# EAGLE design BLE Monitor Orientation Sensor (EAGLE 9.2.2)
CREVISION: 1; DESIGNER: Roshni Sharma, TJ Rodriguez
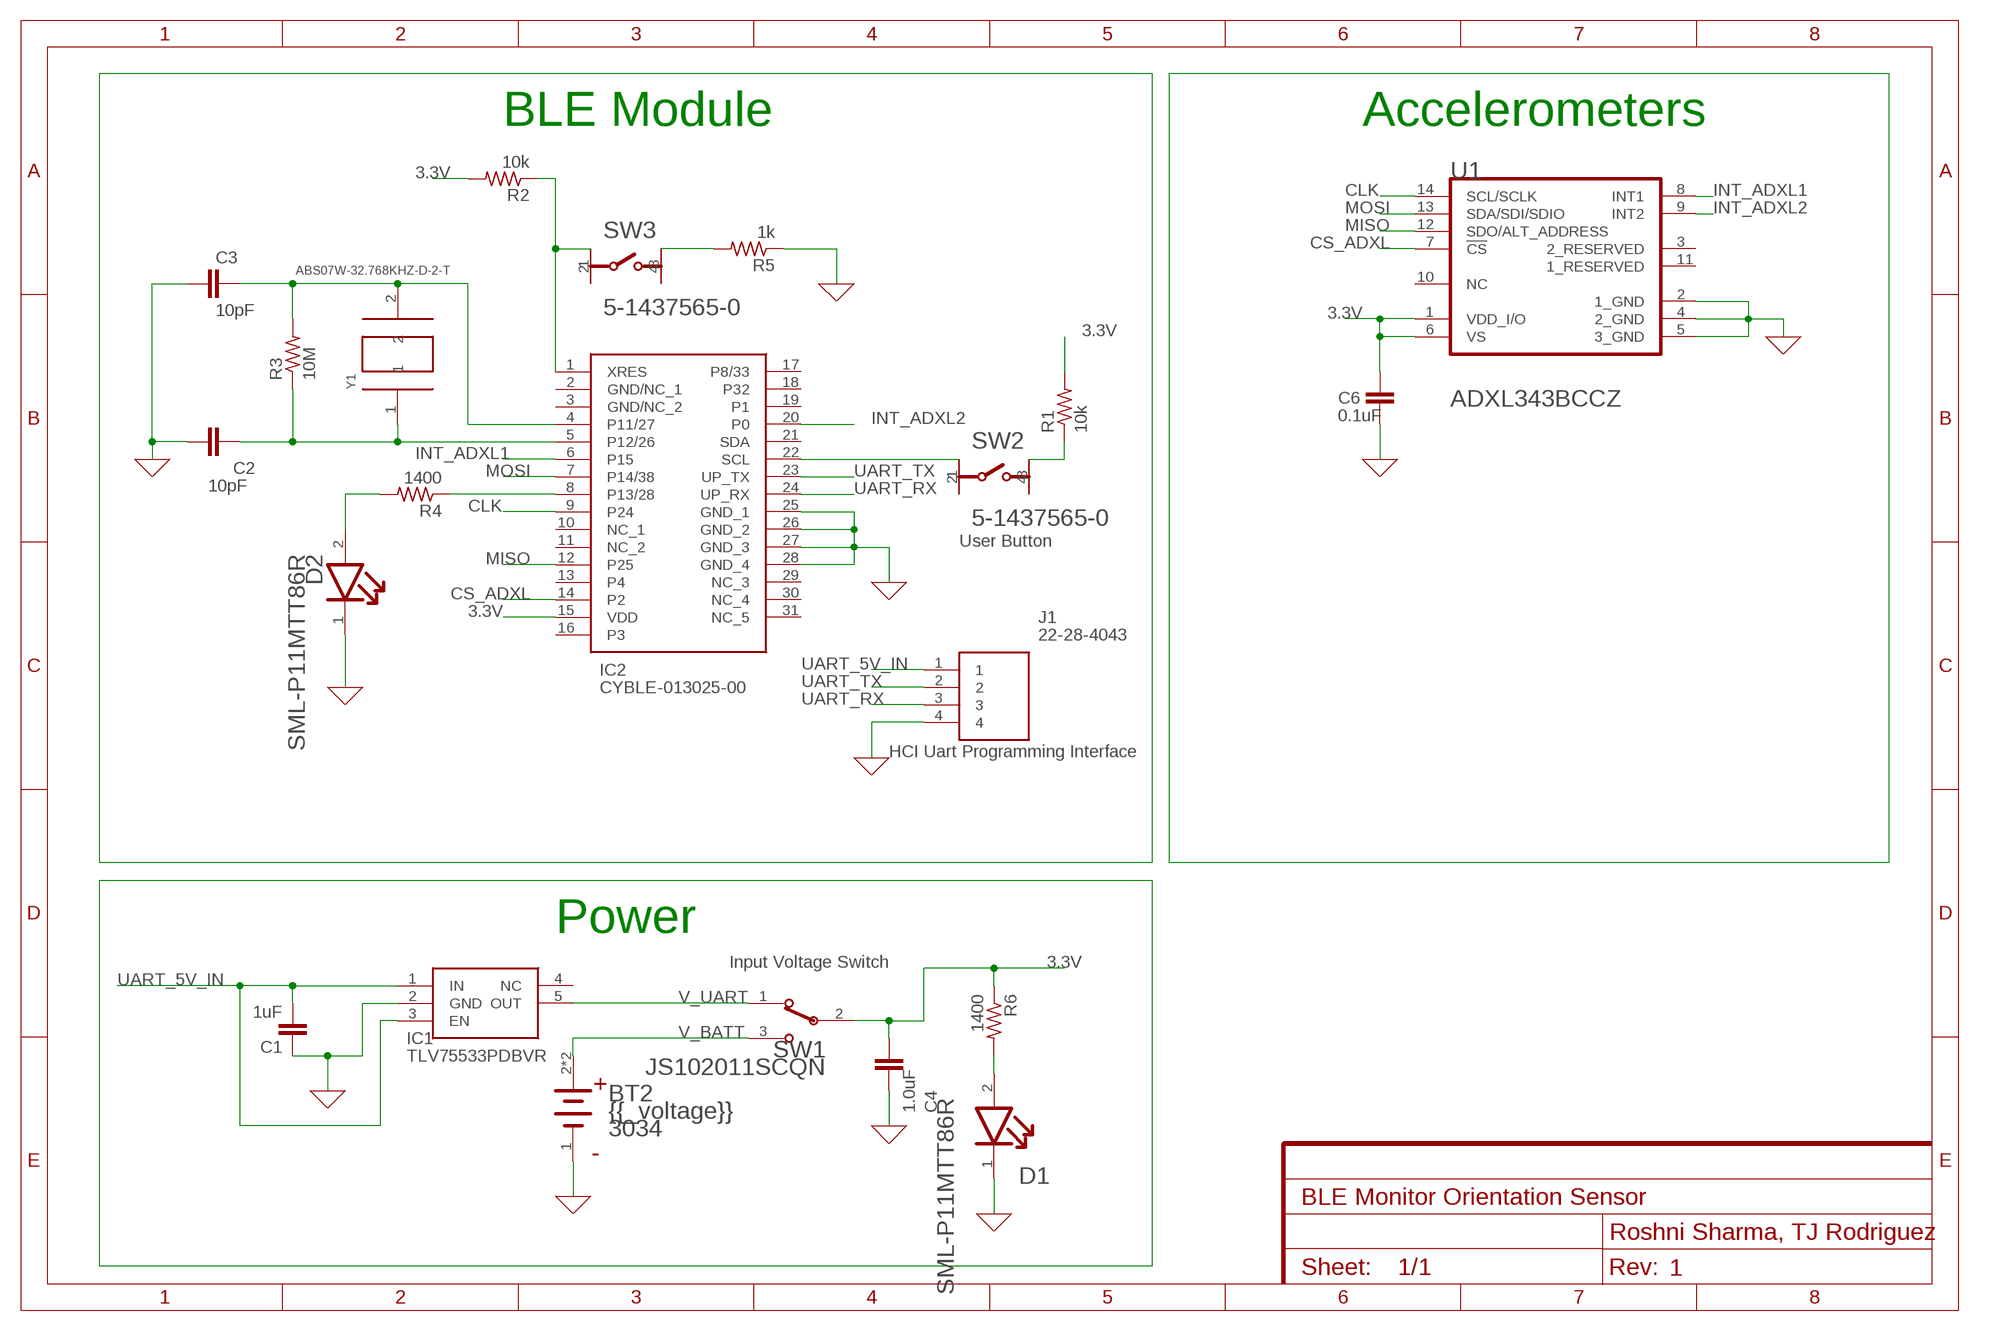
[diagram p0: schematic, sheet 1]

## Parts
BT2  KEYSTONE_ELECTRONICS_3034KEYSTONE_ELECTRONICS_3034_0_0  [KEYSTONE_ELECTRONICS_3034_0]
C1  1uF  10PF-0603-50V-5%  [0603]
C2  10pF  10PF-0603-50V-5%  [0603]
C3  10pF  10PF-0603-50V-5%  [0603]
C4  1.0uF  1.0UF-0603-16V-10%  [0603]
C6  0.1uF  10PF-0603-50V-5%  [0603]
D1  ROHM_SML-P11MTT86RROHM_SML-P11MTT86R_0_0  [ROHM_SML-P11MTT86R_0]
D2  ROHM_SML-P11MTT86RROHM_SML-P11MTT86R_0_0  [ROHM_SML-P11MTT86R_0]
IC1  TLV75533PDBVR  [SOT95P280X145-5N]
IC2  CYBLE-013025-00  [CYBLE01302500]
J1  22-28-4043  [HDRV4W87P0X254_1X4_1016X249X86]
R1  10k  R-US_R0603  [R0603]
R2  10k  R-US_R0603  [R0603]
R3  10M  R-US_R0603  [R0603]
R4  1400  R-US_R0603  [R0603]
R5  1k  R-US_R0603  [R0603]
R6  1400  R-US_R0603  [R0603]
SW1  C&K_JS102011SCQNC&K_JS102011SCQN_0_0  [C&K_JS102011SCQN_0]
SW2  TE_CONNECTIVITY_5-1437565-0TE_CONNECTIVITY_5-1437565-0_0_0  [TE_CONNECTIVITY_5-1437565-0_0]
SW3  TE_CONNECTIVITY_5-1437565-0TE_CONNECTIVITY_5-1437565-0_0_0  [TE_CONNECTIVITY_5-1437565-0_0]
U1  ANALOG_DEVICES_ADXL343BCCZANALOG_DEVICES_ADXL343BCCZ_0_0  [ANALOG_DEVICES_ADXL343BCCZ_0]
Y1  ABS07W-32.768KHZ-D-2-T  [XTAL320X150X90]

## Nets
3.3V [power_500mA_5V]: C4.1 C6.2 IC2.15(VDD) R1.2 R2.2 R6.1 SW1.2 U1.1(VDD_I/O) U1.6(VS)
CLK: IC2.9(P24) U1.14(SCL/SCLK)
CS_ADXL: IC2.14(P2) U1.7(!CS!)
GND: BT2.1(CATHODE) C1.1 C2.1 C3.1 C4.2 C6.1 D1.1(CATHODE) D2.1(CATHODE) IC1.2(GND) IC2.25(GND_1) IC2.26(GND_2) IC2.27(GND_3) IC2.28(GND_4) J1.4 R5.1 U1.2(1_GND) U1.4(2_GND) U1.5(3_GND)
INT_ADXL1: IC2.6(P15) U1.8(INT1)
INT_ADXL2: IC2.20(P0) U1.9(INT2)
MISO: IC2.12(P25) U1.12(SDO/ALT_ADDRESS)
MOSI: IC2.7(P14/38) U1.13(SDA/SDI/SDIO)
N$1: R1.1 SW2.3
N$2: IC2.1(XRES) R2.1 SW3.1
N$3: IC2.22(SCL) SW2.1
N$4: IC2.8(P13/28) R4.1
N$5: D1.2(ANODE) R6.2
N$6: D2.2(ANODE) R4.2
N$7: R5.2 SW3.3
N$8: C2.2 IC2.5(P12/26) R3.1 Y1.1
N$9: C3.2 IC2.4(P11/27) R3.2 Y1.2
UART_5V_IN: C1.2 IC1.1(IN) IC1.3(EN) J1.1
UART_RX: IC2.24(UP_RX) J1.3
UART_TX: IC2.23(UP_TX) J1.2
V_BATT: BT2.2(ANODE) BT2.2-2(ANODE) SW1.3
V_UART: IC1.5(OUT) SW1.1
Unconnected: IC1.4(NC) IC2.2(GND/NC_1) IC2.3(GND/NC_2) IC2.10(NC_1) IC2.11(NC_2) IC2.13(P4) IC2.16(P3) IC2.17(P8/33) IC2.18(P32) IC2.19(P1) IC2.21(SDA) IC2.29(NC_3) IC2.30(NC_4) IC2.31(NC_5) SW2.2 SW2.4 SW3.2 SW3.4 U1.3(2_RESERVED) U1.10(NC) U1.11(1_RESERVED)

## Notes on the sheet
- BLE Module | Accelerometers
- Power

## Library data of the parts
BT2 = Keystone Electronics - 3034:KEYSTONE_ELECTRONICS_3034: Coin Cell Battery Holders COIN CELL RETAINER; AUTOMOTIVE: No; CENTROID_NOT_SPECIFIED: No; CONTACT_MATERIAL: Nickel; DATASHEET: https://www.keyelco.com/product-pdf.cfm?p=798; DEVICE_CLASS_L1: Connectors; DEVICE_CLASS_L2: unset; DEVICE_CLASS_L3: unset; DIGIKEY_DESCRIPTION: BATTERY RETAINER COIN 20MM SMD; DIGIKEY_PART_NUMBER: 36-3034-ND; FOOTPRINT_VARIANT_NAME_0: Recommended_Land_Pattern; HEIGHT: 4.31mm; LEAD_FREE: Yes; MF: Keystone Electronics; MFG_PACKAGE_IDENT: 3034; MFG_PACKAGE_IDENT_DATE: 0; MFG_PACKAGE_IDENT_REV: 0; MOUSER_DESCRIPTION: Coin Cell Battery Holders COIN CELL RETAINER; MOUSER_PART_NUMBER: 534-3034; MPN: 3034; NUMBER_OF_CONTACTS: 2; PACKAGE: SMT_COIN_CELL; PREFIX: BT; ROHS: Yes; VERIFICATION_VERSION: 0.0.0.2
C1 C6 = SparkFun-Capacitors:10PF: 10pF ceramic capacitors A capacitor is a passive two-terminal electrical component used to store electrical energy temporarily in an electric field.; PROD_ID: CAP-11812; VALUE: 10pF
C2 C3 = SparkFun-Capacitors:10PF: 10pF ceramic capacitors A capacitor is a passive two-terminal electrical component used to store electrical energy temporarily in an electric field.; PROD_ID: CAP-11812
C4 = SparkFun-Capacitors:1.0UF: 1µF ceramic capacitors A capacitor is a passive two-terminal electrical component used to store electrical energy temporarily in an electric field.; PROD_ID: CAP-00868
D1 D2 = ROHM - SML-P11MTT86R:ROHM_SML-P11MTT86R: LED Uni-Color Yellow Green Chip LED 2-Pin 0402 T/R; AUTOMOTIVE: No; CENTROID_NOT_SPECIFIED: No; COLOUR: Yellowish Green; DATASHEET: https://www.rohm.com/datasheet/SML-P11MT(R)/sml-p11-e; DEVICE_CLASS_L1: Optoelectronics; DEVICE_CLASS_L2: LEDs; DEVICE_CLASS_L3: unset; DIGIKEY_DESCRIPTION: DIODE LED YELLOW-GRN CLEAR 0402 SMD; DIGIKEY_PART_NUMBER: 846-1211-1-ND; FOOTPRINT_VARIANT_NAME_0: Recommended_Land_Pattern; FORWARD_CURRENT: 1mA; FORWARD_VOLTAGE: 1.9V; HEIGHT: 0.25mm; LEAD_FREE: Yes; LED_ORIENTATION: Top View; LUMINOUS_INTENSITY: 2.1mcd; MF: ROHM; MFG_PACKAGE_IDENT: SML-P1; MFG_PACKAGE_IDENT_DATE: 0; MFG_PACKAGE_IDENT_REV: 0; MOUSER_DESCRIPTION: SML-P11 Series Yellow Green 0402 Clear 2.1 mcd 1.9 V Surface Mount PICOLED? LED; MOUSER_PART_NUMBER: 755-SML-P11MTT86R; MPN: SML-P11MTT86R; PACKAGE: 0402; POWER_DISSIPATION: 54mW; PREFIX: D; REVERSE_VOLTAGE: 5V; ROHS: Yes; TEMPERATURE_RANGE_HIGH: +85°C; TEMPERATURE_RANGE_LOW: -40°C; VERIFICATION_VERSION: 0.0.0.1; WAVELENGTH: 569nm
IC1 = TLV75533PDBVR:TLV75533PDBVR: LDO Voltage Regulators 500-mA, Low IQ, Small Size, Low Dropout Regulator 5-SOT-23 -40 to 125 Source: Datasheet <http://www.ti.com/lit/gpn/tlv755p>; ARROW_PART_NUMBER: TLV75533PDBVR; ARROW_PRICE-STOCK: https://www.arrow.com/en/products/tlv75533pdbvr/texas-instruments; DESCRIPTION: LDO Voltage Regulators 500-mA, Low IQ, Small Size, Low Dropout Regulator 5-SOT-23 -40 to 125; HEIGHT: 1.45mm; MANUFACTURER_NAME: Texas Instruments; MANUFACTURER_PART_NUMBER: TLV75533PDBVR; MOUSER_PART_NUMBER: 595-TLV75533PDBVR; MOUSER_PRICE-STOCK: https://www.mouser.co.uk/ProductDetail/Texas-Instruments/TLV75533PDBVR?qs=55YtniHzbhAKEwqeO2xJXQ%3D%3D
IC2 = SamacSys_Parts:CYBLE-013025-00: Bluetooth Modules (802.15.1) BLE Module Source: Datasheet <https://www.arrow.com/en/products/cyble-013025-00/cypress-semiconductor>; ARROW_PART_NUMBER: CYBLE-013025-00; ARROW_PRICE-STOCK: https://www.arrow.com/en/products/cyble-013025-00/cypress-semiconductor; DESCRIPTION: Bluetooth Modules (802.15.1) BLE Module; HEIGHT: 2.25mm; MANUFACTURER_NAME: Cypress Semiconductor; MANUFACTURER_PART_NUMBER: CYBLE-013025-00; MOUSER_PART_NUMBER: 727-CYBLE-013025-00; MOUSER_PRICE-STOCK: https://www.mouser.co.uk/ProductDetail/Cypress-Semiconductor/CYBLE-013025-00?qs=F5EMLAvA7IA%252BPnWrPsxPuQ%3D%3D; SPICEPREFIX: X
J1 = 22-28-4043:22-28-4043: Molex 42375 Series, Series Number 2228, 2.54mm Pitch 4 Way 1 Row Straight PCB Header, Solder Termination, 4A Source: Datasheet <https://componentsearchengine.com/Datasheets/1/22-28-4043.pdf>; DESCRIPTION: Molex 42375 Series, Series Number 2228, 2.54mm Pitch 4 Way 1 Row Straight PCB Header, Solder Termination, 4A; FUNCTION: HCI Uart Programming Interface; HEIGHT: 8.63mm; MANUFACTURER_NAME: Molex; MANUFACTURER_PART_NUMBER: 22-28-4043; MOUSER_PART_NUMBER: 538-22-28-4043; MOUSER_PRICE-STOCK: https://www.mouser.com/Search/Refine.aspx?Keyword=538-22-28-4043
R1-R6 = rcl:R-US_: RESISTOR, American symbol; SPICEPREFIX: R
SW1 = C&K - JS102011SCQN:C&K_JS102011SCQN: Switch Slide SPDT Top Slide 0.3A 30VDC Gull Wing SMD T/R; CENTROID_NOT_SPECIFIED: No; CONTACT_CURRENT_RATING: 0.3A; CONTACT_RESISTANCE: 70mΩ; CURRENT_RATING: 300mA; DATASHEET: https://www.ckswitches.com/media/1422/js.pdf; DEVICE_CLASS_L1: Electromechanical; DEVICE_CLASS_L2: Switches; DEVICE_CLASS_L3: Slide Switches; DIGIKEY_DESCRIPTION: SWITCH SLIDE SPDT 300MA 6V; DIGIKEY_PART_NUMBER: CKN10877CT-ND; ELECTROMECHANICAL_LIFE: 5000Cycles; FUNCTION: Input Voltage Switch; HEIGHT: 5.5mm; LEAD_FREE: yes; MF: C&K; MFG_PACKAGE_IDENT: JS102011SCQN; MFG_PACKAGE_IDENT_DATE: 0; MFG_PACKAGE_IDENT_REV: 0; MOUSER_DESCRIPTION: Switch Slide SPDT Top Slide 0.3A 30VDC Gull Wing SMD T/R; MOUSER_PART_NUMBER: 611-JS102011SCQN; MPN: JS102011SCQN; PACKAGE: SMT_SW_8MM5_3MM5; PREFIX: SW; ROHS: yes; TEMPERATURE_RANGE_HIGH: +85°C; TEMPERATURE_RANGE_LOW: -40°C; THROW_CONFIGURATION: SPDT; VERIFICATION_VERSION: 0.0.0.1; VOLTAGE_RATING_DC: 6V
SW2 = TE Connectivity - 5-1437565-0:TE_CONNECTIVITY_5-1437565-0: TE CONNECTIVITY / ALCOSWITCH Tactile Switch, Non Illuminated, 24 V, 50 mA, 150 gf, Solder; AUTOMOTIVE: No; CENTROID_NOT_SPECIFIED: No; CONTACT_CURRENT_RATING: 50mA; CONTACT_RESISTANCE: 100mΩ; DATASHEET: https://www.te.com/commerce/DocumentDelivery/DDEController?Action=showdoc&DocId=Customer+Drawing%7F2-1437565-7%7FV%7Fpdf%7FEnglish%7FENG_CD_2-1437565-7_V.pdf%7F3-1437565-0; DEVICE_CLASS_L1: Electromechanical; DEVICE_CLASS_L2: Switches; DEVICE_CLASS_L3: Tactile Switches; DIGIKEY_DESCRIPTION: SWITCH TACTILE SPST-NO 0.05A 24V; DIGIKEY_PART_NUMBER: 450-2058-1-ND; ELECTROMECHANICAL_LIFE: 100000Cycles; FOOTPRINT_VARIANT_NAME_0: Recommended_Land_Pattern; FUNCTION: User Button; HEIGHT: 7.26mm; LEAD_FREE: Yes; MF: TE Connectivity; MFG_PACKAGE_IDENT: 5-1437565-0; MFG_PACKAGE_IDENT_DATE: 0; MFG_PACKAGE_IDENT_REV: 0; MOUSER_DESCRIPTION: Tactile Switches FSM6JSMATR; MOUSER_PART_NUMBER: 506-5-1437565-0; MPN: 5-1437565-0; OPERATING_FORCE: 160gf; PACKAGE: SMT_SW_6MM0_6MM9; PREFIX: SW; ROHS: Yes; STANDOFF_HEIGHT: 0.05mm; TEMPERATURE_RANGE_HIGH: +85°C; TEMPERATURE_RANGE_LOW: -35°C; THROW_CONFIGURATION: SPST; VERIFICATION_VERSION: 0.0.0.1; VOLTAGE_RATING_DC: 24V
SW3 = TE Connectivity - 5-1437565-0:TE_CONNECTIVITY_5-1437565-0: TE CONNECTIVITY / ALCOSWITCH Tactile Switch, Non Illuminated, 24 V, 50 mA, 150 gf, Solder; AUTOMOTIVE: No; CENTROID_NOT_SPECIFIED: No; CONTACT_CURRENT_RATING: 50mA; CONTACT_RESISTANCE: 100mΩ; DATASHEET: https://www.te.com/commerce/DocumentDelivery/DDEController?Action=showdoc&DocId=Customer+Drawing%7F2-1437565-7%7FV%7Fpdf%7FEnglish%7FENG_CD_2-1437565-7_V.pdf%7F3-1437565-0; DEVICE_CLASS_L1: Electromechanical; DEVICE_CLASS_L2: Switches; DEVICE_CLASS_L3: Tactile Switches; DIGIKEY_DESCRIPTION: SWITCH TACTILE SPST-NO 0.05A 24V; DIGIKEY_PART_NUMBER: 450-2058-1-ND; ELECTROMECHANICAL_LIFE: 100000Cycles; FOOTPRINT_VARIANT_NAME_0: Recommended_Land_Pattern; FUNCTION: Reset; HEIGHT: 7.26mm; LEAD_FREE: Yes; MF: TE Connectivity; MFG_PACKAGE_IDENT: 5-1437565-0; MFG_PACKAGE_IDENT_DATE: 0; MFG_PACKAGE_IDENT_REV: 0; MOUSER_DESCRIPTION: Tactile Switches FSM6JSMATR; MOUSER_PART_NUMBER: 506-5-1437565-0; MPN: 5-1437565-0; OPERATING_FORCE: 160gf; PACKAGE: SMT_SW_6MM0_6MM9; PREFIX: SW; ROHS: Yes; STANDOFF_HEIGHT: 0.05mm; TEMPERATURE_RANGE_HIGH: +85°C; TEMPERATURE_RANGE_LOW: -35°C; THROW_CONFIGURATION: SPST; VERIFICATION_VERSION: 0.0.0.1; VOLTAGE_RATING_DC: 24V
U1 = Analog Devices - ADXL343BCCZ:ANALOG_DEVICES_ADXL343BCCZ: ADI-ADXL34X-CC-14-1; 3DB_BANDWIDTH: 1.6 KHz; CIIVA_IDS: 2416245; COMPONENT_LINK_1_DESCRIPTION: Manufacturer URL; COMPONENT_LINK_1_URL: http://www.analog.com/en/index.html; COMPONENT_LINK_3_DESCRIPTION: Package Specification; COMPONENT_LINK_3_URL: http://www.analog.com/static/imported-files/data_sheets/ADXL343.pdf; COMPONENT_LINK_4_DESCRIPTION: Product URL; COMPONENT_LINK_4_URL: http://www.analog.com/en/mems-sensors/mems-inertial-sensors/adxl343/products/product.html; DATASHEET: http://www.analog.com/static/imported-files/data_sheets/ADXL343.pdf; DATASHEET_VERSION: Rev. 0; FOOTPRINT_VARIANT_NAME_0: Manufacturer Recommended; IMPORTED: yes; IMPORTED_FROM: vault; IMPORT_TS: 1521862076; MF: Analog Devices; MOUNTING_TECHNOLOGY: Surface Mount; MPN: ADXL343BCCZ; OF_AXES: 3; OUTPUT_TYPE: Digital; PACKAGE: CC-14-1; PACKAGE_DESCRIPTION: 14-Pin Land Grid Array, 3 x 5 mm Body, 0.8 mm Pitch; PACKAGE_VERSION: 03-16-2010-A, 03/2010; PACKING: Tray; PIN_0_0_13_INSIDE_EDGE: clock; PREFIX: U; RELEASE_DATE: 1396258511; SENSITIVITY: 256/128/64/32 LSB/g; VAULT_GUID: 1FF5E9B5-0480-4B9F-B006-41E6078ADD26; VAULT_REVISION: DC90A2D0-DCCE-40AA-9931-88A066B9F432; VOLTAGE_SUPPLY_V: 2.0 to 3.6
Y1 = ABS07W-32.768KHZ-D-2-T:ABS07W-32.768KHZ-D-2-T: ABS07 Series 32.768 kHz ±20 ppm 12.5 pF -40 to +85 C SMT Low Profile Crystal; DESCRIPTION: 32.768kHz ±20ppm Crystal 3pF 55 kOhms 2-SMD, No Lead; DIGI-KEY_PART_NUMBER: 535-14105-1-ND; MF: Abracon; MP: ABS07W-32.768KHZ-D-2-T; PACKAGE: SMD-2 Abracon; PURCHASE-URL: https://pricing.snapeda.com/search/part/ABS07W-32.768KHZ-D-2-T/?ref=eda; SPICEPREFIX: B

## Net classes
0 signal: width 0.152 mm, clearance 0.152 mm
1 power_500mA_5V: width 0.254 mm, clearance 0.152 mm

## Board
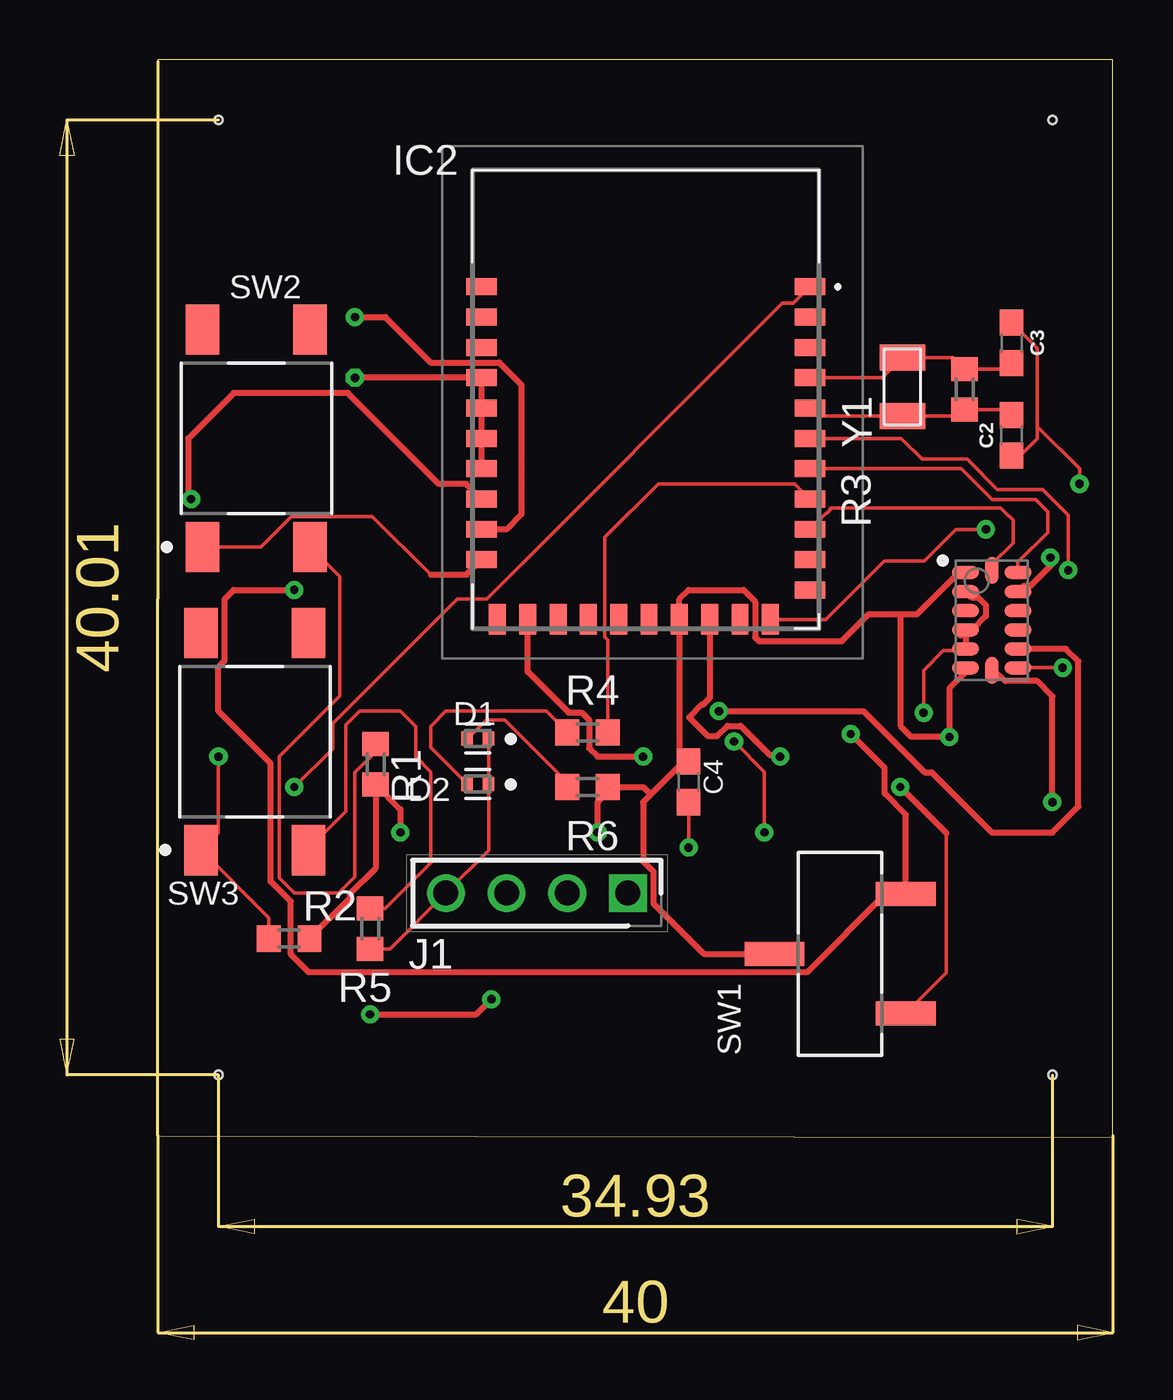
[diagram p1: board, top side]
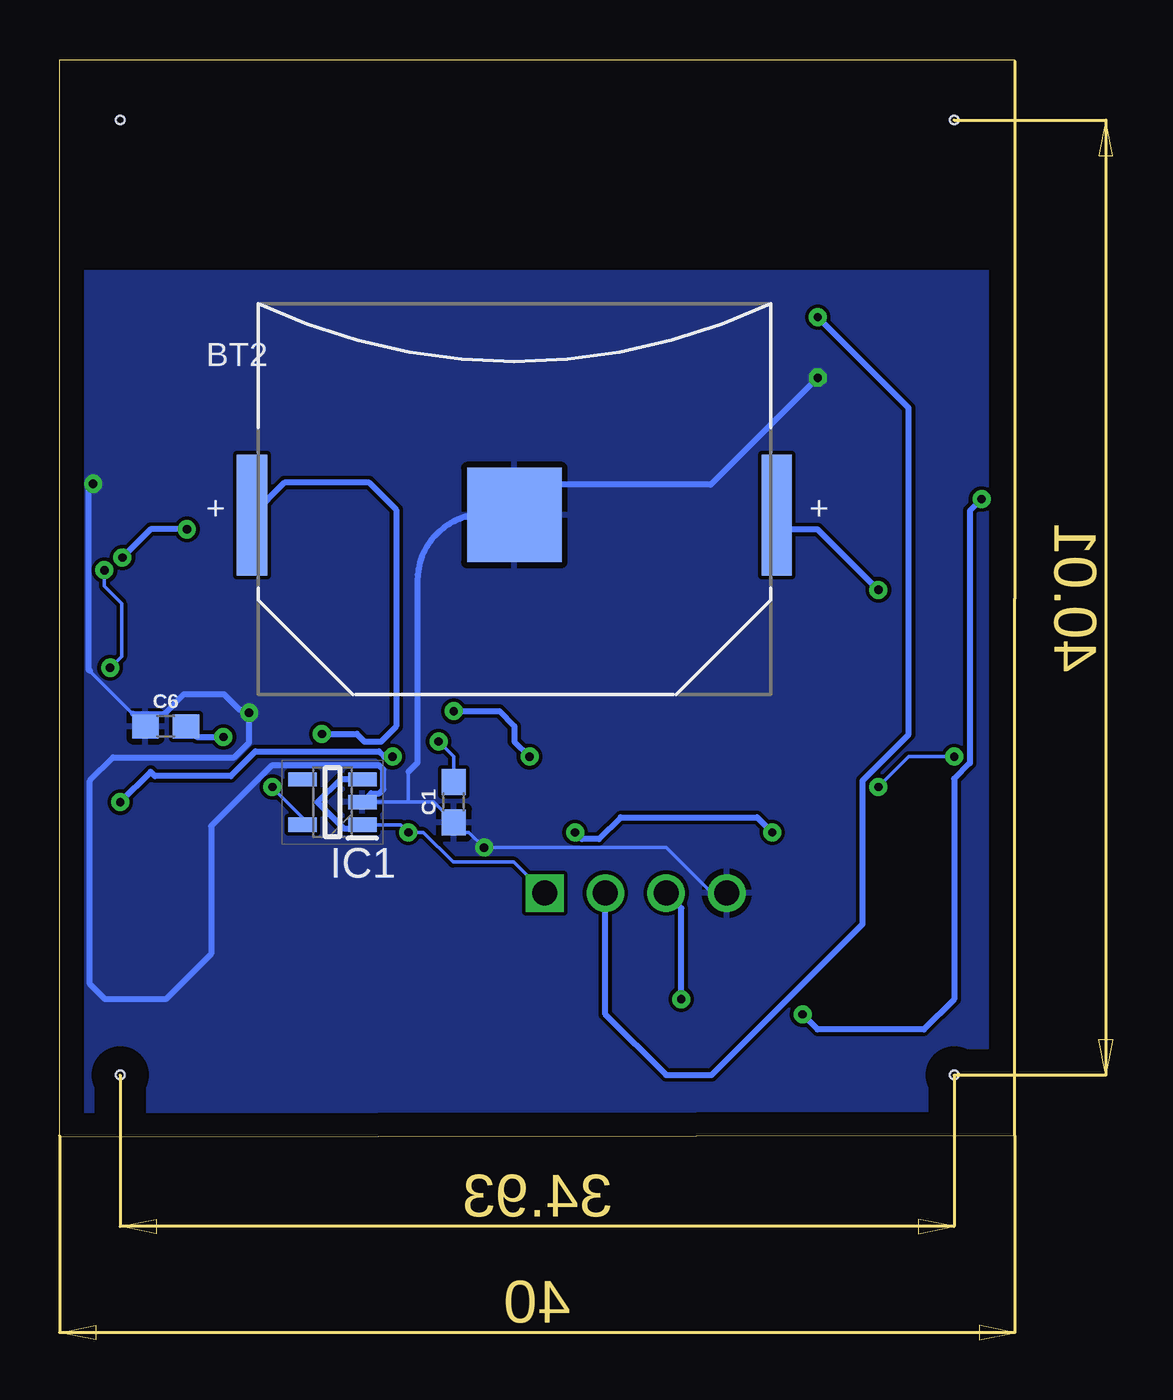
[diagram p2: board, bottom side, seen from below]

Size 39.99 x 45.14 mm. Coordinates in mm from the lower left corner, seen from the top.
Outline: 0,0.06 39.99,0 39.99,45.14 0,45.14 0,0.06
Copper layers (1*16): Top 0.035mm / dielectric 1.5mm / Bottom 0.035mm
Design rules "default": minimum track width 6mil, minimum drill 0.35mm, track to track 6mil, track to pad 6mil, pad to pad 6mil, via to via 6mil, smd to smd 6mil, copper to edge 40mil, drill to drill 6mil, minimum pad ring 10mil, minimum via ring 8mil, stop-mask expansion 4mil, vias tented up to drill 0mil, thermal gap 10mil
Holes 0.35 mm at 2.54,2.6 37.47,2.6 2.54,42.61 37.47,42.61

### Footprints (pad centres in the part's own frame; a part is rotated, then mirrored left to right if it is on the bottom)
KEYSTONE_ELECTRONICS_3034_0 = smd 3.96 x 3.96: 1 0,-0.67 | smd 1.27 x 5.08: 2 -10.985,-0.67; 2-2 10.985,-0.67
0603 = smd 1.1 x 1: 1 -0.85,0; 2 0.85,0
ROHM_SML-P11MTT86R_0 = smd 0.5 x 0.6: 1 -0.45,0; 2 0.45,0
SOT95P280X145-5N = smd 1.2 x 0.6: 1 -1.25,0.95; 2 -1.25,0; 3 -1.25,-0.95; 4 1.25,-0.95; 5 1.25,0.95
CYBLE01302500 = smd 1.27 x 0.71: 1 0,0; 2 0,-1.27; 3 0,-2.54; 4 0,-3.81; 5 0,-5.08; 6 0,-6.35; 7 0,-7.62; 8 0,-8.89; 9 0,-10.16; 10 0,-11.43; 11 0,-12.7; 22 -13.75,-11.43; 23 -13.75,-10.16; 24 -13.75,-8.89; 25 -13.75,-7.62; 26 -13.75,-6.35; 27 -13.75,-5.08; 28 -13.75,-3.81; 29 -13.75,-2.54; 30 -13.75,-1.27; 31 -13.75,0 | smd 0.71 x 1.27: 12 -1.655,-13.935; 13 -2.925,-13.935; 14 -4.195,-13.935; 15 -5.465,-13.935; 16 -6.735,-13.935; 17 -8.005,-13.935; 18 -9.275,-13.935; 19 -10.545,-13.935; 20 -11.815,-13.935; 21 -13.085,-13.935
HDRV4W87P0X254_1X4_1016X249X86 = drill 1.05 pad 1.575 square: 1 0,0 | drill 1.05 pad 1.575: 2 2.54,0; 3 5.08,0; 4 7.62,0
R0603 = smd 1 x 1.1: 1 -0.85,0; 2 0.85,0
C&K_JS102011SCQN_0 = smd 1 x 2.5: 1 -2.5,-2.75; 2 0,2.75; 3 2.5,-2.75
TE_CONNECTIVITY_5-1437565-0_0 = smd 1.4 x 2.1: 1 2.25,4.55; 2 2.25,-4.55; 3 -2.25,4.55; 4 -2.25,-4.55
ANALOG_DEVICES_ADXL343BCCZ_0 = smd 1.145 x 0.55: 1 -1.098,2; 2 -1.098,1.2; 3 -1.098,0.4; 4 -1.098,-0.4; 5 -1.098,-1.2; 6 -1.098,-2; 8 1.097,-2; 9 1.097,-1.2; 10 1.097,-0.4; 11 1.097,0.4; 12 1.097,1.2; 13 1.097,2 | smd 0.55 x 1.145: 7 0,-2.097; 14 0,2.097
XTAL320X150X90 = smd 1.092 x 1.905: 1 -1.219,0; 2 1.219,0

### Placement (x,y rotation side)
BT2  20.95,26.73 0 bottom
C1  23.5,14.03 90 bottom
C2  35.75,29.4 90 top
C3  35.75,33.27 270 top
C4  22.23,14.88 270 top
C6  35.56,17.21 0 bottom
D1  13.4,16.7 180 top
D2  13.4,14.8 180 top
IC1  28.57,14.03 180 bottom
IC2  27.3,35.62 0 top
J1  19.68,10.22 180 top
R1  9.12,15.62 270 top
R2  5.5,8.32 0 top
R3  33.78,31.33 90 top
R4  18,16.95 180 top
R5  8.89,8.74 90 top
R6  18,14.67 180 top
SW1  28.57,7.68 90 top
SW2  4.13,29.27 180 top
SW3  4.06,16.57 180 top
U1  34.92,21.65 0 top
Y1  31.18,31.43 90 top

### Tracks (layer width: path | path; a pad name or v marks a point on that pad's centre or on a via)
3.3V  (via drill 0.35)
  Top 0.254: 22.12,15.84 21.84,16.12 IC2.15 21.84,22.54 22.23,22.92 24.53,22.92 25.02,22.44 25.02,20.94 25.18,20.77 28.64,20.77 29.78,21.91 31.11,21.91 | 22.12,15.84 C4.1 | R2.2 8.06,10.03 8.06,10.21 9.12,11.26 R1.2 10.16,13.73 v10.16,12.76 | 20.64,14.35 20.32,14.03 20.32,11.56 20.75,11.13 20.75,9.79 22.86,7.68 SW1.2 | 20.64,14.35 22.12,15.84 | R6.1 19.05,14.67 | 19.05,14.67 20.32,14.67 20.64,14.35 | U1.6 33.83,19.49 33.15,18.81 v33.15,16.77 31.56,16.77 31.11,17.21 31.11,21.91 | v18.41,12.76 18.41,14.03 19.05,14.67 | U1.1 33.69,23.52 33.41,23.52 31.8,21.91 31.11,21.91
  Bottom 0.254: v10.16,12.76 10.79,13.4 16.51,13.4 17.42,12.48 18.14,12.48 v18.41,12.76 | C6.2 34.27,16.77 v33.15,16.77
CLK
  Top 0.152: U1.14 34.92,24 34.93,24 35.81,24.89 35.81,25.84 35.75,25.91 35.56,26.1 35.31,26.35 28.19,26.35 28.17,26.33 28.17,26.28 28.04,26.15 27.99,26.15 IC2.9
CS_ADXL  (via drill 0.35)
  Top 0.254: IC2.14 23.11,18.39 22.84,18.12 22.77,18.12 22.25,17.59 23.03,16.81 23.43,16.81 23.86,17.23 24.4,17.23 25.63,16 26.04,16 26.06,15.98 v26.06,15.94 | v37.47,14.03 37.47,18.46 36.83,19.1 35.49,19.1 35.04,19.56 U1.7
  Bottom 0.254: v26.06,15.94 26.41,15.94 26.63,16.16 31.8,16.16 32.84,15.13 36.02,15.13 36.2,15.3 v37.47,14.03
GND  (via drill 0.35)
  Top 0.152: U1.5 33.76,20.39 32.89,20.39 32.89,20.38 32.07,19.56 v32.07,17.78 | R5.1 9.73,7.89 J1.4 13.85,12.01 D2.1 D1.1 | C2.1 36.11,28.55 36.83,29.27 36.83,29.77 | 36.83,29.77 36.83,33.05 C3.1 | C4.2 v22.23,12.13 | v38.6,27.37 38.6,28 36.83,29.77
  Top 0.254: U1.4 U1.5 | U1.4 arc-90 33.59,21.02 U1.4 | v8.26,31.81 IC2.28 IC2.27 IC2.26 IC2.25 | U1.4 34.11,21.25 34.68,21.82 34.68,22.28 34.35,22.61 34.07,22.61 U1.2
  Bottom 0.152: 21.59,26.06 BT2.1 19.68,27.33 | IC1.2 25.4,14.03 | 25.4,14.03 24.34,14.03 23.6,13.29 | 23.6,13.29 C1.1 | 25.4,15.3 25.4,14.03 | 23.6,13.29 23.5,13.4 23.5,12.76 22.86,12.76 v22.23,12.13 14.61,12.13 12.7,10.22 J1.4 | C6.1 36.94,17.74 38.73,19.53
  Bottom 0.254: 21.59,26.06 22.19,26.06 arc90 22.23,26.1 arc-90 25.02,23.3 25.02,15.69 25.4,15.3 | v8.26,31.81 12.73,27.33 19.68,27.33 | IC1.2 26.95,14.4 26.61,14.4 26.45,14.57 26.45,15.4 26.61,15.56 31.13,15.56 33.66,13.04 33.66,7.68 35.56,5.78 38.1,5.78 38.73,6.41 38.73,14.94 37.76,15.91 32.69,15.91 32.07,16.53 v32.07,17.78 32.19,17.91 32.47,17.91 33.12,18.56 34.8,18.56 35.63,17.74 36.94,17.74 | 38.73,19.53 38.79,19.59 38.79,27.18 v38.6,27.37
  pour Bottom: 0,0.06 0,36.26 40.01,36.26 40.01,0.06
INT_ADXL1  (via drill 0.35)
  Top 0.152: IC2.6 31.13,29.27 32.01,28.4 33.9,28.4 35.16,27.14 37.06,27.14 38.13,26.07 v38.13,23.75 | v37.89,19.66 36.03,19.66 U1.8
  Bottom 0.152: v38.13,23.75 38.13,23.08 37.4,22.35 37.4,20.13 37.87,19.66 v37.89,19.66
INT_ADXL2  (via drill 0.35)
  Top 0.254: v23.5,17.84 29.55,17.84 32.11,15.28 32.41,15.28 34.92,12.76 37.47,12.76 38.55,13.85 38.55,19.94 38.03,20.45 U1.9 | v20.32,15.94 18.42,15.94 18.07,16.29 18.07,17.48 17.76,17.78 17.2,17.78 15.49,19.5 IC2.20
  Bottom 0.254: v23.5,17.84 21.59,17.84 20.95,17.21 20.95,16.57 v20.32,15.94
MISO  (via drill 0.35)
  Top 0.152: IC2.12 27.98,21.69 30.42,24.14 32.09,24.14 33.41,25.46 v34.67,25.46
  Top 0.254: U1.12 36.27,23.1 36.55,23.1 37.38,23.93 v37.38,24.28
  Bottom 0.254: v37.38,24.28 36.19,25.47 v34.67,25.47 v34.67,25.46
MOSI
  Top 0.152: IC2.7 33.66,28 34.95,26.71 36.77,26.71 37.27,26.2 37.27,25.34 36.02,24.08 U1.13
N$1
  Top 0.152: SW2.3 7.62,23.48 7.62,18.48 5.08,15.94 5.08,10.86 5.71,10.22 7.58,10.22 8.26,10.9 8.26,15.28 9.12,16.14 R1.1
N$2  (via drill 0.35)
  Top 0.152: R2.1 4.65,9.19 SW3.1 2.54,12.75 v2.54,15.94 | IC2.1 26.62,34.94 26.16,34.94 13.77,22.55 12.53,22.55 7.32,17.34 7.32,16.27 v5.71,14.67
  Bottom 0.152: v5.71,14.67 4.45,15.94 v2.54,15.94
N$3
  Top 0.152: SW2.1 4.3,24.72 5.58,26 8.99,26 11.43,23.56
  Top 0.254: IC2.22 12.92,23.56 11.43,23.56
N$4
  Top 0.152: R4.1 18.84,20.83 18.72,20.96 18.72,25.13 20.95,27.37 26.67,27.37 IC2.8
N$5
  Top 0.152: D1.2 12.97,16.7 13.76,17.48 14.52,17.48 17.14,14.86 R6.2
N$6
  Top 0.152: D2.2 11.43,16.31 11.43,17.21 12.06,17.84 16.26,17.84 R4.2
N$7
  Top 0.152: R5.2 9.53,9.59 11.43,11.49 11.43,15.3 10.79,15.94 10.79,17.21 10.16,17.84 8.45,17.84 7.87,17.27 7.87,13.65 7.62,13.4 6.31,12.09
  Top 0.254: 6.31,12.09 SW3.3
N$8
  Top 0.152: IC2.5 27.64,30.21 Y1.1 33.52,30.21 R3.1 35.52,30.48 C2.2
N$9
  Top 0.152: IC2.4 30.34,31.81 Y1.2 33.31,32.65 R3.2 35.51,32.18 C3.2
UART_5V_IN  (via drill 0.35)
  Top 0.152: v24.13,16.57 25.4,15.3 v25.4,12.76
  Bottom 0.152: C1.2 23.5,15.94 v24.13,16.57 | IC1.1 25.72,13.08 v25.4,12.76 24.77,12.76 23.52,11.52 20.98,11.52 J1.1
  Bottom 0.254: IC1.1 27.48,12.93 28.11,12.93 29.21,14.03 28.26,14.98 IC1.3
UART_RX  (via drill 0.35)
  Top 0.254: IC2.24 12.92,27.37 11.77,27.37 7.96,31.18 3.17,31.18 1.27,29.27 1.27,26.73 v1.39,26.73 | v8.89,5.14 13.34,5.14 v13.97,5.78
  Bottom 0.254: v1.39,26.73 1.88,26.25 1.88,15.67 2.54,15.01 2.54,5.78 3.81,4.51 8.26,4.51 v8.89,5.14 | v13.97,5.78 13.97,9.59 J1.3
UART_TX  (via drill 0.35)
  Top 0.254: v8.26,34.35 9.53,34.35 11.43,32.45 14.31,32.45 15.24,31.51 15.24,26.1 14.61,25.46 IC2.23
  Bottom 0.254: J1.2 17.14,5.14 14.61,2.6 12.7,2.6 6.37,8.93 6.37,14.94 4.45,16.87 4.45,30.54 v8.26,34.35
V_BATT  (via drill 0.35)
  Top 0.254: v5.71,22.92 3.17,22.92 2.79,22.54 2.79,19.96 2.54,19.7 2.54,17.84 4.72,15.66 4.72,10.71 5.57,9.87 5.57,7.65 6.32,6.91 27.19,6.91 30.47,10.18 SW1.3 31.32,13.51 30.43,14.4 30.43,15.48 v29.02,16.89
  Bottom 0.254: BT2.2-2 10.16,25.87 10.16,25.46 8.26,25.46 v5.71,22.92 | v29.02,16.89 27.56,16.89 27.24,16.57 26.54,16.57 25.91,17.21 25.91,26.29 27.03,27.41 30.59,27.41 BT2.2
V_UART  (via drill 0.35)
  Top 0.152: SW1.1 33.02,6.88 33.02,12.74
  Top 0.254: 33.02,12.74 v31.09,14.67
  Bottom 0.152: v31.09,14.67 31.1,14.66 29.82,13.38 IC1.5